# EasyEDA Pro project OpenIPC-Optical(工程文件)2025-11-24.epro, board UrmoukyOpenIPC
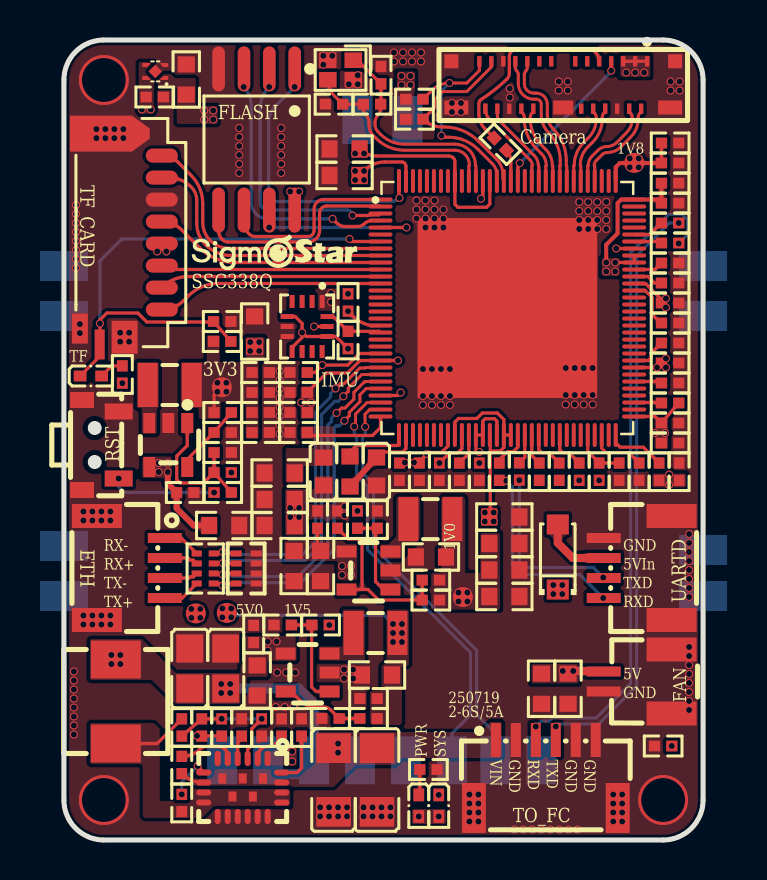
[diagram p7: board, top side]
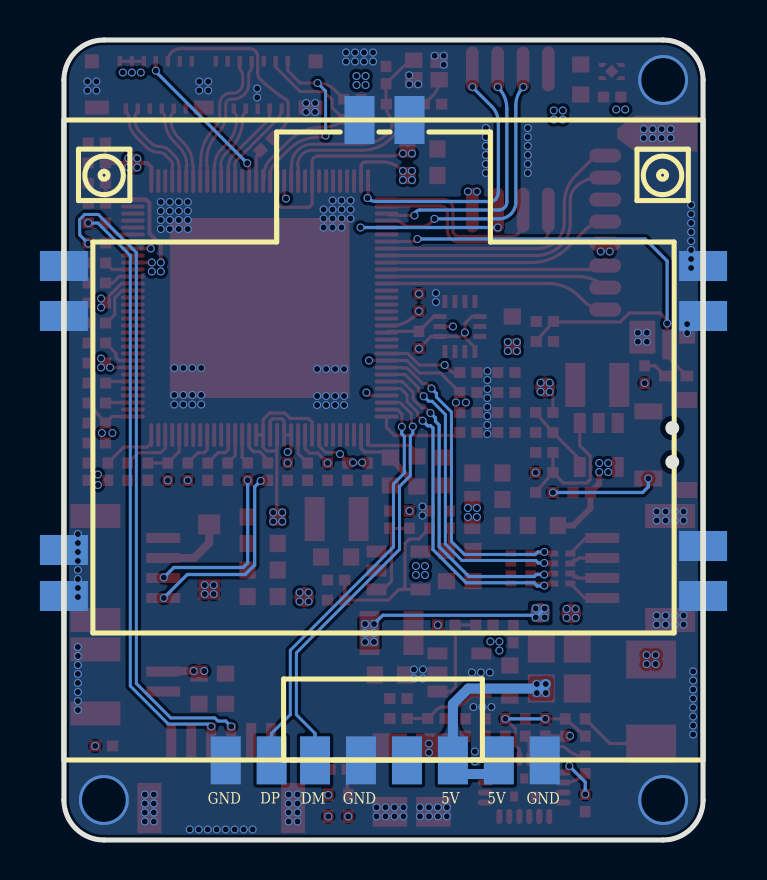
[diagram p8: board, bottom side, seen from below]

Outline 32 x 40 mm; copper layers: Top Layer, Inner1, Inner2, Bottom Layer. Coordinates in mm from the lower left corner of the outline.
Outline path: 0,38 0,2 arc(0.59,0.59) 2,0 30,0 arc(31.41,0.59) 32,2 32,38 arc(31.41,39.41) 30,40 2,40 arc(0.59,39.41) 0,38
Stack: Top Layer 0.035mm 外层铜厚1oz / Dielectric1 0.2104mm 7628 RC49% 8.6mil / Inner1 0.0152mm 内层铜厚 / Dielectric2 1.065mm 1.1mm H/HOZ Copper / Inner2 0.0152mm 内层铜厚 / Dielectric3 0.2104mm 7628 RC49% 8.6mil / Bottom Layer 0.035mm 外层铜厚1oz

## Design rules (mm)
net ETH_TX+: ETH_TX
net ETH_TX-: ETH_TX
net ETH_RX+: ETH_RX
net ETH_RX-: ETH_RX
net XTAL_OUT: XTAL
net XTAL_IN: XTAL
net USB_DM: USB
net USB_DP: USB
net MIPI_D0+: MIPI_D0
net MIPI_CK+: MIPI_CK
net MIPI_CK-: MIPI_CK
net I2C1_SCL: DP1
net I2C1_SDA: DP1
net MIPI_D0-: MIPI_D0
net MIPI_D1+: MIPI_D1
net MIPI_D2+: MIPI_D2
net MIPI_D2-: MIPI_D2
net MIPI_D3+: MIPI_D3
net MIPI_D3-: MIPI_D3
net MIPI_D1-: MIPI_D1
template: 自定义配置
spacing copperThickness1oz (default): track to track 0.102, other pairs 0 to 0.3
spacing copperThickness2oz: track to track 0.203, other pairs 0.152 to 0.3
track width copperThickness1oz (default): min 0.15, default 0.16, max 2
track width copperThickness2oz: min 0.203, default 0.254, max 2.54
differential pair differentialPair (default): width min 0.127, default 0.15, max 2.54; gap min 0.152, default 0.152
via viaSize (default): diameter min 0.4, default 0.4, max 10; hole min 0.3, default 0.3, max 5

## Placement (name value [footprint] x y rotation side)
1V0  -  [Test-Point-0.5mm]  19.97 12.15 0 top
1V5  -  [Test-Point-0.5mm]  8.15 11.36 0 top
1V8  -  [Test-Point-0.5mm]  28.55 33.86 0 top
3V3  -  [Test-Point-0.5mm]  7.91 22.64 0 top
5V0  -  [Test-Point-0.5mm]  6.6 11.33 0 top
C2  22uF  [R0603]  9.55 25.42 270 top
C5  47pF  [R0402]  18.37 12 0 top
C6  10uF  [R0603]  18.38 14.15 0 top
C9  10uF  [R0603]  15.68 8.25 0 top
C11  100nF  [R0402]  15.25 7.08 0 top
C17  10uF  [R0603]  8.03 15.72 180 top
C19  10uF  [R0603]  12.85 13.7 90 top
C20  100nF  [R0402]  12.7 16.02 270 top
C21  10uF  [R0603]  9.68 7.97 90 top
C22  100nF  [R0402]  9.5 10.3 270 top
C23  10uF  [R0603]  14.05 33.22 0 top
C26  1uF  [R0402]  7.95 19.38 180 top
C27  100nF  [R0402]  10.95 10.75 0 top
C28  100nF  [R0402]  15.7 16.02 270 top
C30  10uF  [R0603]  10.8 17.03 0 top
C31  10uF  [R0603]  10.8 15.72 0 top
C32  100nF  [R0402]  18.8 18.42 90 top
C33  100nF  [R0402]  30.35 20.85 180 top
C34  100nF  [R0402]  30.35 19.85 180 top
C35  100nF  [R0402]  30 4.7 0 top
C36  100nF  [R0402]  30.35 26.85 180 top
C37  100nF  [R0402]  11.75 22.38 0 top
C38  100nF  [R0402]  4.55 37.15 180 top
C39  10uF  [R0603]  10.8 18.35 0 top
C40  100nF  [R0402]  11.75 20.38 180 top
C41  10uF  [R0603]  22.05 16.15 180 top
C42  100nF  [R0402]  16.8 18.42 90 top
C43  100nF  [R0402]  17.8 18.42 90 top
C46  10uF  [R0603]  22.05 14.83 180 top
C47  10uF  [R0603]  22.05 13.5 180 top
C48  10uF  [R0603]  22.05 12.17 180 top
C49  10uF  [R0603]  14.05 34.55 0 top
C50  100nF  [R0402]  20.8 18.42 90 top
C51  100nF  [R0402]  11.75 23.38 0 top
C53  100nF  [R0402]  30.35 32.84 180 top
C54  100nF  [R0402]  30.35 31.84 180 top
C57  100nF  [R0402]  30.35 33.85 180 top
C58  100nF  [R0402]  19.8 18.42 90 top
C59  100nF  [R0402]  30.35 24.85 180 top
C60  10uF  [R0603]  14.32 18.42 270 top
C61  100nF  [R0402]  30.8 18.42 90 top
C63  100nF  [R0402]  27.8 18.42 270 top
C64  100nF  [R0402]  11.75 21.38 0 top
C65  100nF  [R0402]  30.35 23.85 0 top
C71  30pF  [R0402]  13.52 36.79 180 top
C72  30pF  [R0402]  15.87 38.24 90 top
C77  33nF  [R0402]  8.9 5.62 270 top
C78  100nF  [R0402]  5.9 1.85 270 top
C79  390pF  [R0402]  7.9 5.62 90 top
C80  22uF  [C0805]  8.1 8.58 270 top
C81  22uF  [C0805]  6.3 8.58 270 top
C82  1uF  [R0402]  11.9 5.62 90 top
C83  22uF  [C1206]  13.5 3 90 top
C84  22uF  [C1206]  15.68 3 90 top
C85  10uF  [R0603]  6.12 38.03 270 top
C86  100nF  [R0402]  30.35 34.85 180 top
C87  10uF  [R0603]  11.53 13.7 90 top
C88  100nF  [R0402]  9.85 20.38 180 top
C89  100nF  [R0402]  9.85 21.38 180 top
C90  100nF  [R0402]  9.85 22.38 180 top
C91  100nF  [R0402]  9.85 23.38 180 top
C92  100nF  [R0402]  6.07 17.38 180 top
C93  10uF  [R0603]  23.91 7.56 90 top
C94  10uF  [R0603]  25.24 7.56 90 top
CN2  SH1.0-4PWB  [CONN-SMD_4P-P1.00_WAFER-SH1.0-4PWB]  28.72 13.6 90 top
CN3  SH1.0-4PWB  [CONN-SMD_4P-P1.00_WAFER-SH1.0-4PWB]  3.35 13.6 270 top
CN6  WAFER-SH1.0-6PWB  [CONN-SMD_6P-P1.00_XUNPU_WAFER-SH1.0-6PWB]  24.12 3.3 0 top
DF1  -  [DF56C-26S-0.3V(51)]  25 37.75 180 top
F1  100nF  [CAP-ARRAY-SMD_0508-8P-L2.0-W1.3-BL]  9.12 13.58 90 top
L2  2.2uH  [IND-SMD_L2.5-W2.0_MHCHL2520]  5.3 22.75 0 top
L3  2.2uH  [IND-SMD_L2.5-W2.0_MHCHL2520]  18.35 16.05 0 top
L4  2.2uH  [IND-SMD_L2.5-W2.0_MHCHL2520]  15.6 10.35 0 top
L5  CBM160808U121T  [L0603]  13 18.42 90 top
L6  CBM160808U600T  [L0603]  15.65 18.42 90 top
L7  10uH  [IND-SMD_L5.2-W5.2_MCW-0530]  2.6 6.92 90 top
LED1  NCD0402G1  [LED0402-RD]  17.77 1.72 270 top
LED2  NCD0402G1  [LED0402-RD]  18.77 1.72 270 top
LED3  NCD0402G1  [LED0402-RD]  1.35 23.2 0 top
R3  150K  [R0402]  7.95 21.38 180 top
R4  51K  [R0402]  18.37 13 0 top
R5  15K  [R0402]  15.25 6.08 0 top
R8  100K  [R0402]  7.95 18.38 180 top
R9  33K  [R0402]  7.95 20.38 180 top
R10  100K  [R0402]  12.85 10.75 180 top
R11  100K  [R0402]  14.7 16.02 270 top
R12  75K  [R0402]  13.7 16.02 270 top
R13  10K  [R0402]  13.35 6.08 0 top
R15  4.7K  [R0402]  18.25 3.53 0 top
R16  4.7K  [R0402]  25.8 18.42 90 top
R19  100  [R0402]  21.8 18.42 90 top
R20  100  [R0402]  22.8 18.42 90 top
R21  4.7K  [R0402]  14.22 25 270 top
R22  4.7K  [R0402]  14.22 26.88 90 top
R23  100  [R0402]  24.8 18.42 90 top
R24  100  [R0402]  23.8 18.42 90 top
R25  4.7K  [R0402]  30.35 22.85 0 top
R26  10K  [R0402]  26.8 18.42 90 top
R27  4.7K  [R0402]  30.35 21.85 0 top
R28  100Ω  [R0402]  7.95 17.38 180 top
R29  4.7K  [R0402]  28.8 18.42 90 top
R30  200K  [R0402]  29.8 18.42 90 top
R35  100K  [R0402]  30.35 25.85 180 top
R36  100  [R0402]  30.35 27.85 180 top
R37  100  [R0402]  30.35 28.85 180 top
R38  100  [R0402]  30.35 29.85 180 top
R39  100  [R0402]  30.35 30.85 180 top
R40  1M/NC  [R0402]  15.42 36.79 180 top
R41  22R  [R0402]  21.85 34.79 135 top
R42  4.7K  [R0402]  17.55 36.04 180 top
R43  4.7K  [R0402]  17.55 37.04 180 top
R44  4.7K  [R0402]  7.93 24.92 0 top
R45  100kΩ  [R0402]  10.9 5.62 270 top
R46  500kΩ  [R0402]  5.9 3.75 90 top
R47  845k  [R0402]  5.9 5.62 90 top
R48  53.6k  [R0402]  6.9 5.62 270 top
R49  10k  [R0402]  9.9 5.62 270 top
R53  NC  [R0402]  7.93 25.92 0 top
R54  4.7K  [R0402]  2.93 23.28 90 top
RN1  10Ω  [RES-ARRAY-SMD_0402-8P-L2.0-W1.0-BL]  7.07 13.58 90 top
SD1  TF-027-H300  [TF-SMD_HYCW104-TF08-375B]  2.85 30.05 90 top
SW1  TS24CA 250gf 013  [SW-SMD_L4.7-W3.5-P3.35-EH]  1.82 19.75 90 top
U1  -  [QFN128_12.3_12.3]  22.2 26.6 0 top
U3  TMI3113B  [SOT-23-5_L2.9-W1.6-P0.95-LS2.8-BR]  5.22 19.75 90 top
U4  TMI3411  [SOT-23-5_L2.9-W1.6-P0.95-LS2.8-BL]  15.25 13.47 90 top
U5  TMI3408F  [SOT-23-5_L2.9-W1.6-P0.95-LS2.8-BL]  12.2 8.38 90 top
U7  W25Q128JVSIQ  [SOIC-8_L5.3-W5.3-P1.27-LS8.0-BL]  9.65 35.03 180 top
U9  ICM-42670-P  [LGA-14_L3.0-W2.5-P0.50-TL_QMI8658A]  12.18 25.67 270 top
U11  MP9447GL-Z  [QFN-20_L4.0-W3.0_MP9447GL]  8.95 2.62 270 top
U13  -  [BL-M8812EU2]  16 20 180 bottom
U14  DS8561-18D4  [DFN-4_L1.0-W1.0-P0.65-BL-EP]  4.57 38.42 90 top
U15  DSS210  [SOD-123_L2.7-W1.8-LS3.7-RD]  24.72 14.15 90 top
U18  BX-SH1.0-2PWT  [CONN-SMD_2P-P1.00_BX-SH1.0-2PWT]  28.72 7.92 90 top
X1  24MHz  [CRYSTAL-SMD_4P-L2.0-W1.6-BL-A]  13.85 38.5 180 top

## Footprints (pads in the part's own frame, mm; a bottom-side part is the same pattern mirrored in y, then rotated)
BL-M8812EU2
  rect 1.5x2.4 smd: 1(-7.9,-16.019) 2(-5.6,-16.019) 3(-3.427,-16.019) 4(-1.127,-16.019) 5(1.173,-16.019) 6(3.473,-16.019) 7(5.773,-16.019) 8(8.073,-16.019) 13(1.3,16) 14(-1.2,16)
  rect 2.4x1.5 smd: 9(16,-7.8) 10(16,-5.3) 11(16,6.2) 12(16,8.7) 15(-16,8.7) 16(-16,6.2) 17(-16,-5.5) 18(-16,-7.8)
C0805
  rect 1.41x1.35 smd: 1(-1,0) 2(1,0)
C1206
  rect 1.485x1.728 smd: 1(-1.593,0) 2(1.593,0)
CAP-ARRAY-SMD_0508-8P-L2.0-W1.3-BL
  rect 0.3x0.55 smd: 1(-0.75,-0.5) 2(-0.25,-0.5) 3(0.25,-0.5) 4(0.75,-0.5) 5(0.75,0.5) 6(0.25,0.5) 7(-0.25,0.5) 8(-0.75,0.5)
CONN-SMD_2P-P1.00_BX-SH1.0-2PWT
  rect 0.5x1.7 smd: 1(-0.5,1.7) 2(0.5,1.7)
  rect 1.2x2.5 smd: 3(1.6,-1.7) 4(-1.6,-1.7)
CONN-SMD_4P-P1.00_WAFER-SH1.0-4PWB
  rect 0.5x1.7 smd: 1(-1.5,1.7) 2(-0.5,1.7) 3(0.5,1.7) 4(1.5,1.7)
  rect 1.2x2.5 smd: 5(-2.6,-1.7) 6(2.6,-1.7)
CONN-SMD_6P-P1.00_XUNPU_WAFER-SH1.0-6PWB
  rect 0.5x1.7 smd: 1(-2.5,1.7) 2(-1.5,1.7) 3(-0.5,1.7) 4(0.5,1.7) 5(1.5,1.7) 6(2.5,1.7)
  rect 1.2x2.5 smd: 7(3.6,-1.7) 8(-3.6,-1.7)
CRYSTAL-SMD_4P-L2.0-W1.6-BL-A
  rect 0.875x0.775 smd: 1(-0.638,-0.488) 2(0.638,-0.488) 3(0.638,0.488) 4(-0.638,0.488)
DF56C-26S-0.3V(51)
  rect 0.22x0.52 smd: 1(-4.2,-1.185) 2(-3.9,1.185) 3(-3.6,-1.185) 4(-3.3,1.185) 5(-3,-1.185) 6(-2.7,1.185) 7(-2.4,-1.185) 8(-2.1,1.185) 9(-1.8,-1.185) 10(-1.5,1.185) 11(-1.2,-1.185) 12(-0.9,1.185) 13(-0.6,-1.185) 14(0.6,-1.185) 16(1.2,-1.185) 17(1.5,1.185) 18(1.8,-1.185) 19(2.1,1.185) 20(2.4,-1.185) 21(2.7,1.185) 22(3,-1.185) 23(3.3,1.185) 24(3.6,-1.185) 25(3.9,1.185) 26(4.2,-1.185)
  rect 1x0.7 smd: 27(0,1.125)
  rect 1.2x0.7 smd: 28(-5.35,1.125) 29(5.35,1.125)
  rect 0.7x0.7 smd: 30(-5.6,-1.185) 31(5.6,-1.185)
DFN-4_L1.0-W1.0-P0.65-BL-EP
  custom 0.2x0.4 smd: 1(-0.325,-0.475) 2(0.325,-0.474) 3(0.325,0.475) 4(-0.325,0.475)
  rect 0.48x0.48 smd rot 45: 5(0.004,0.001)
IND-SMD_L2.5-W2.0_MHCHL2520
  rect 1x2.2 smd: 1(-1.1,0) 2(1.1,0)
IND-SMD_L5.2-W5.2_MCW-0530
  rect 1.9x2.5 smd: 1(-2.1,0) 2(2.1,0)
L0603
  rect 0.8x0.864 smd: 1(-0.7,0) 2(0.7,0)
LED0402-RD
  rect 0.636x0.54 smd: 1(-0.538,0) 2(0.538,0)
LGA-14_L3.0-W2.5-P0.50-TL_QMI8658A
  rect 0.65x0.25 smd: 1(-1.25,0.75) 2(-1.25,0.25) 3(-1.25,-0.25) 4(-1.25,-0.75) 8(1.25,-0.75) 9(1.25,-0.25) 10(1.25,0.25) 11(1.25,0.75)
  rect 0.25x0.65 smd: 5(-0.5,-1) 6(0,-1) 7(0.5,-1) 12(0.5,1) 13(0,1) 14(-0.5,1)
QFN128_12.3_12.3
  oval 1.2x0.2 smd: 1(-6.35,5.425) 2(-6.35,5.075) 3(-6.35,4.725) 4(-6.35,4.375) 5(-6.35,4.025) 6(-6.35,3.675) 7(-6.35,3.325) 8(-6.35,2.975) 9(-6.35,2.625) 10(-6.35,2.275) 11(-6.35,1.925) 12(-6.35,1.575) 13(-6.35,1.225) 14(-6.35,0.875) 15(-6.35,0.525) 16(-6.35,0.175) 17(-6.35,-0.175) 18(-6.35,-0.525) 19(-6.35,-0.875) 20(-6.35,-1.225) 21(-6.35,-1.575) 22(-6.35,-1.925) 23(-6.35,-2.275) 24(-6.35,-2.625) 25(-6.35,-2.975) 26(-6.35,-3.325) 27(-6.35,-3.675) 28(-6.35,-4.025) 29(-6.35,-4.375) 30(-6.35,-4.725) 31(-6.35,-5.075) 32(-6.35,-5.425) 65(6.35,-5.425) 66(6.35,-5.075) 67(6.35,-4.725) 68(6.35,-4.375) 69(6.35,-4.025) 70(6.35,-3.675) 71(6.35,-3.325) 72(6.35,-2.975) 73(6.35,-2.625) 74(6.35,-2.275) 75(6.35,-1.925) 76(6.35,-1.575) 77(6.35,-1.225) 78(6.35,-0.875) 79(6.35,-0.525) 80(6.35,-0.175) 81(6.35,0.175) 82(6.35,0.525) 83(6.35,0.875) 84(6.35,1.225) 85(6.35,1.575) 86(6.35,1.925) 87(6.35,2.275) 88(6.35,2.625) 89(6.35,2.975) 90(6.35,3.325) 91(6.35,3.675) 92(6.35,4.025) 93(6.35,4.375) 94(6.35,4.725) 95(6.35,5.075) 96(6.35,5.425)
  oval 0.2x1.2 smd: 33(-5.425,-6.35) 34(-5.075,-6.35) 35(-4.725,-6.35) 36(-4.375,-6.35) 37(-4.025,-6.35) 38(-3.675,-6.35) 39(-3.325,-6.35) 40(-2.975,-6.35) 41(-2.625,-6.35) 42(-2.275,-6.35) 43(-1.925,-6.35) 44(-1.575,-6.35) 45(-1.225,-6.35) 46(-0.875,-6.35) 47(-0.525,-6.35) 48(-0.175,-6.35) 49(0.175,-6.35) 50(0.525,-6.35) 51(0.875,-6.35) 52(1.225,-6.35) 53(1.575,-6.35) 54(1.925,-6.35) 55(2.275,-6.35) 56(2.625,-6.35) 57(2.975,-6.35) 58(3.325,-6.35) 59(3.675,-6.35) 60(4.025,-6.35) 61(4.375,-6.35) 62(4.725,-6.35) 63(5.075,-6.35) 64(5.425,-6.35) 97(5.425,6.35) 98(5.075,6.35) 99(4.725,6.35) 100(4.375,6.35) 101(4.025,6.35) 102(3.675,6.35) 103(3.325,6.35) 104(2.975,6.35) 105(2.625,6.35) 106(2.275,6.35) 107(1.925,6.35) 108(1.575,6.35) 109(1.225,6.35) 110(0.875,6.35) 111(0.525,6.35) 112(0.175,6.35) 113(-0.175,6.35) 114(-0.525,6.35) 115(-0.875,6.35) 116(-1.225,6.35) 117(-1.575,6.35) 118(-1.925,6.35) 119(-2.275,6.35) 120(-2.625,6.35) 121(-2.975,6.35) 122(-3.325,6.35) 123(-3.675,6.35) 124(-4.025,6.35) 125(-4.375,6.35) 126(-4.725,6.35) 127(-5.075,6.35) 128(-5.425,6.35)
  rect 9x9 smd: 129(0,0)
QFN-20_L4.0-W3.0_MP9447GL
  oval 0.76x0.3 smd: 1(-1.45,1.25) 2(-1.45,0.75) 3(-1.45,0.25) 4(-1.45,-0.25) 5(-1.45,-0.75) 6(-1.45,-1.25) 11(1.45,-1.25) 12(1.45,-0.75) 13(1.45,-0.25) 14(1.45,0.25) 15(1.45,0.75) 16(1.45,1.25)
  oval 0.3x0.76 smd: 7(-0.75,-1.95) 8(-0.25,-1.95) 9(0.25,-1.95) 10(0.75,-1.95) 17(0.75,1.95) 18(0.25,1.95) 19(-0.25,1.95) 20(-0.75,1.95)
  rect 0.5x0.4 smd: 21(-0.45,1.02) 22(-0.45,0) 23(-0.45,-1.02) 24(0.45,0.51) 25(0.45,-0.51)
R0402
  rect 0.566x0.54 smd: 1(-0.433,0) 2(0.433,0)
R0603
  rect 0.806x0.864 smd: 1(-0.753,0) 2(0.753,0)
RES-ARRAY-SMD_0402-8P-L2.0-W1.0-BL
  rect 0.3x0.505 smd: 1(-0.75,0.427) 2(-0.25,0.427) 3(0.25,0.427) 4(0.75,0.427) 5(0.75,-0.427) 6(0.25,-0.427) 7(-0.25,-0.427) 8(-0.75,-0.427)
SOD-123_L2.7-W1.8-LS3.7-RD
  rect 1x1.1 smd: 1(-1.627,0) 2(1.627,0)
SOIC-8_L5.3-W5.3-P1.27-LS8.0-BL
  oval 0.63x2.25 smd: 1(-1.905,-3.53) 2(-0.635,-3.53) 3(0.635,-3.53) 4(1.905,-3.53) 5(1.905,3.53) 6(0.635,3.53) 7(-0.635,3.53) 8(-1.905,3.53)
SOT-23-5_L2.9-W1.6-P0.95-LS2.8-BL
  rect 0.6x1 smd: 1(-0.95,-1.1) 2(0,-1.1) 3(0.95,-1.1) 4(0.95,1.1) 5(-0.95,1.1)
SOT-23-5_L2.9-W1.6-P0.95-LS2.8-BR
  rect 1x0.6 smd: 1(1.1,-0.95) 2(1.1,0) 3(1.1,0.95) 4(-1.1,0.95) 5(-1.1,-0.95)
SW-SMD_L4.7-W3.5-P3.35-EH
  rect 0.8x1.4 smd: 1(-1.675,-0.917) 2(1.675,-0.917)
  rect 0.8x1.2 smd: 3(-2.25,0.917) 4(2.25,0.917)
Test-Point-0.5mm
  round 1 smd: 1(0,0)
TF-SMD_HYCW104-TF08-375B
  oval 0.7x1.6 smd: 1(-3.53,-2.05) 2(-2.43,-2.05) 3(-1.33,-2.05) 4(-0.23,-2.05) 5(0.87,-2.05) 6(1.97,-2.05) 7(3.07,-2.05) 8(4.17,-2.05)
  rect 1.5x0.5 smd: 9(-5.27,1.06)
  rect 1.5x0.8 smd: 10(-4.48,2.05)
  rect 1.65x1.3 smd: 11(-4.91,-0.19)
  custom 1.8x4 smd: 11(5.27,0.55)

## Nets
As in the schematic.

Pads without a net: DF1 11 12 13 14 16; U1 14 15 16 17 18 35 36 37 38 39 66 74 75 76 77 78 79 80 81 82 92 93 94 95 98 99 110 119 121 122 123 124 125 126; U9 2 3 4 9 10 11; U11 6; U13 5

## Via types
v1: diameter 0.4, hole 0.3, Top Layer to Bottom Layer, 388 vias
v2: diameter 2.5, hole 2.2, Top Layer to Bottom Layer, 3 vias

## Routing (per net, layer and track width the routed paths; a pad name or vN(x,y) marks a point on that pad's centre or on a via; arc(x,y) is an arc through that point)
1V0: length 76.2
  Top Layer w0.16: v1(27.6,28.88) U1.87 U1.88 ; C51.2 12.57,23.38 v1(12.94,23.75) 14.21,23.75 14.79,24.33 U1.23 ; 21.68,20.25 21.68,20.95 21.56,21.06 21.09,21.06 20.97,20.95 U1.45 U1.44 20.62,19.4 ; U1.115 21.32,31.8 21.16,31.64 19.72,31.64 19.57,31.79 U1.120 19.57,33.92 arc(19.56,34.02) 19.5,34.1 arc(19.39,34.17) 19.26,34.2 15.65,34.2 arc(15.34,34.24) 15.05,34.36 arc(14.92,34.45) C49.2
  Top Layer w0.2: v1(27.15,28.88) 27.15,29.76 27.72,30.33 27.72,31.84 27.9,32.03 U1.96 29.73,32.03 C54.2 C53.2
  Inner2 w0.16: v1(20.8,18.85) v1(20.8,19.4)
  Inner2 w0.4: 19.97,17.25 16.2,17.25 15.7,17.75 15.7,22.15 15,22.85 ; 19.97,17.25 19.97,17.97 20.8,18.8 v1(20.8,18.85) ; 19.97,17.25 1V0.1 v1(20.2,11.92) ; v1(27.6,28.42) 27.4,28.22 27.4,23.45 26.88,22.92 15.05,22.92 15,22.88 ; 15,22.88 15,30.72 15.78,31.5 15.78,33.92 15.38,34.33 v1(15.03,34.33) v1(14.58,34.33) ; 15,22.88 15,22.85 ; 15,22.85 14.1,23.75 v1(12.94,23.75) 12.93,23.74
  vias: v1(19.75,12.38) v1(19.75,11.92) v1(20.2,12.38) v1(27.15,28.42)
1V5: length 41
  Top Layer w0.16: 21.35,16.15 21.35,20.23 U1.46 ; U1.40 19.22,19.7 18.9,19.38 18.25,19.38 v1(18.18,19.3) 17.8,18.92 17.8,18.85 ; U1.48 22.03,19.62 21.85,19.45 21.38,19.45 ; U1.48 U1.49 ; U1.48 22.03,21.03 21.7,21.35 20.95,21.35 20.68,21.08 19.75,21.08 19.57,20.89 19.57,20.25 U1.41 ; 17.53,18.85 16.8,18.85
  Inner2 w0.16: v1(16.47,10.35) v1(16.93,10.35)
  Inner2 w0.4: 21.3,16.15 21.3,10.75 20.9,10.35 v1(16.93,10.35) ; 21.3,16.15 v1(21.52,16.38) ; 21.3,16.15 21.3,18.22 21.53,18.45 21.53,19.72 21.21,20.04 18.69,20.04 v1(17.53,18.88)
  Bottom Layer w0.16: v1(16.47,10.8) 16.04,11.24 8.26,11.24 8.15,11.35 8.15,11.36 v1(7.93,11.58)
  vias: v1(7.93,11.13) v1(8.38,11.58) v1(8.38,11.13) v1(16.47,9.9) v1(16.93,10.8) v1(16.93,9.9) v1(17.07,18.88) v1(21.07,16.38) v1(21.07,15.92) v1(21.52,15.92)
1V8: length 29.4
  Top Layer w0.16: C86.2 29.92,33.85
  Top Layer w0.2: U1.97 27.62,33.64 27.83,33.85 C57.2
  Inner2 w0.4: 17.12,37.97 v1(16.9,37.75) 15.4,36.25 ; 15.4,36.25 18.72,36.25 19.25,35.72 26.69,35.72 v1(28.33,34.08) v1(28.78,33.63) ; 15.4,36.25 7.25,36.25 v1(7.03,36.47)
  vias: v1(7.03,36.03) v1(7.47,36.47) v1(7.47,36.03) v1(16.9,38.2) v1(17.35,38.2) v1(17.35,37.75) v1(28.33,33.63) v1(28.78,34.08)
3V3: length 27.5
  Top Layer w0.16: 3V3.1 v1(7.68,22.41) 7.52,22.25 R3.2 ; v1(14.22,24.57) 13.62,25.17 U9.12 12.12,25.17 v1(11.93,25.38) ; U1.127 17.12,33.67 arc(17.11,33.77) 17.05,33.85 arc(16.99,33.89) 16.93,33.9 16.05,33.9 arc(15.52,33.79) 15.07,33.5 C23.2 ; v1(20.88,32.07) 20.97,32.16 U1.116 ; v1(16.72,23.97) U1.24 14.82,23.97 14.2,23.35 13.15,23.35 12.18,22.38 C37.2 ; DF1.1 DF1.3 DF1.5 ; v1(16.86,22.37) 16.71,22.22 U1.29 ; 28.55,29.58 v1(27.65,29.58) ; U1.42 19.93,19.57 19.7,19.34 19.29,19.34 v1(18.8,18.85) ; C36.2 29.87,26.9 29.87,27.08 29.59,27.35 29.59,27.35 29.4,27.54 29.4,27.54 29.12,27.83 U1.84 ; v1(11.93,25.38) 11.93,25.13 11.43,24.63 U9.8 ; v1(11.93,25.38) 11.93,25.83 11.57,26.17 U9.5 ; C65.1 v1(29.69,23.62) U1.72 ; U1.65 29.59,21.17 C33.2 R27.2
  vias: v1(2.93,22.84) v1(3.9,36.53) v1(4.35,36.53) v1(4.68,29.42) v1(5.12,29.42) v1(7.68,22.86) v1(8.13,22.86) v1(8.13,22.41) v1(9.32,24.9) v1(9.32,24.45) v1(9.78,24.9) v1(9.78,24.45) v1(11.32,32.42) v1(11.32,16.6) v1(11.32,16.15) v1(11.78,32.42) v1(11.78,16.6) v1(11.78,16.15) v1(11.88,21.88) v1(12.38,21.88) v1(14.22,27.31) v1(14.58,33.45) v1(14.58,33) v1(15.03,33.45) v1(15.03,33) v1(17.77,1.18) v1(18.77,1.18) v1(26.8,17.98) v1(28.15,38.38) v1(28.6,38.38) v1(29.05,38.38) v1(29.57,20.35) v1(30.14,27.08) v1(30.14,26.62) v1(30.14,24.08) v1(30.14,23.62) v1(30.1,20.35) v1(30.3,18.28) v1(30.3,17.75) v1(30.43,4.7)
3V3EN: length 7.5
  Top Layer w0.16: R8.2 8.38,17.38 ; R8.2 6.99,17.85 5.82,17.85 5.65,18.03 5.65,19.2 6.18,19.72 6.18,20.85 ; R8.2 C26.2
5V: length 61.4
  Top Layer w0.16: v1(6.66,5.21) 7.88,5.21 C79.1 ; C19.2 12.7,14.6 C20.2
  Top Layer w0.3: v1(5.2,18.4) 5.2,17.82 C92.2 5.64,16.58 6.5,15.72 C17.2
  Top Layer w0.4: v1(25.5,8.45) 27,8.45 U18.2
  Inner2 w0.16: v1(14.38,13.7) 14.7,14.02 v1(14.7,16.45) ; v1(4.75,18.85) v1(5.2,18.4) 8.36,18.4 v1(8.38,18.38)
  Inner2 w0.4: v1(8.32,7.35) 8.47,7.5 23.85,7.5 24.73,8.38 ; v1(24.5,12.3) 24.73,12.07 24.73,8.38 ; v1(25.5,8.45) 24.8,8.45 24.73,8.38 ; 14.15,13.47 14.15,11.62 v1(13.28,10.75) 12.46,9.92 v1(10.65,9.92) ; v1(5.2,18.4) 6.61,16.99 6.61,11.33 v1(6.83,11.11)
  Bottom Layer w0.5: U13.7 10.23,3.62 10.55,3.3 12.2,3.3 12.53,3.63 12.53,3.83 ; U13.6 12.53,6.8 11.75,7.58 C80.2 v1(7.88,7.8)
  vias: v1(2.38,9.25) v1(2.38,8.8) v1(2.82,9.25) v1(2.82,8.8) v1(4.75,18.4) v1(5.2,18.85) v1(6.38,11.56) v1(6.38,11.11) v1(6.83,11.56) v1(7.88,7.35) v1(8.32,7.8) v1(10.2,9.92) v1(10.2,9.47) v1(13.93,13.7) v1(13.93,13.25) v1(14.38,13.25) v1(24.5,12.75) v1(24.95,12.75) v1(24.95,12.3) v1(24.97,8.45)
AVDD_AUD: length 4.4
  Top Layer w0.16: C40.1 12.33,20.22 15.45,20.22 15.85,20.62 U1.32
GND:
  vias: v1(0.5,8.42) v1(0.5,7.97) v1(0.5,7.53) v1(0.5,7.08) v1(0.5,6.62) v1(0.5,6.17) v1(0.5,5.72) v1(0.5,5.28) v1(0.6,31.75) v1(0.6,31.3) v1(0.6,30.85) v1(0.6,30.4) v1(0.6,29.95) v1(0.6,29.5) v1(0.6,29.05) v1(0.6,28.6) v1(0.8,25.8) v1(0.8,25.34) v1(0.97,16.42) v1(0.97,15.97) v1(0.97,11.22) v1(0.97,10.78) v1(1.43,16.42) v1(1.43,15.97) v1(1.43,11.22) v1(1.43,10.78) v1(1.62,35.55) v1(1.62,35.09) v1(1.88,16.42) v1(1.88,15.97) v1(1.88,11.22) v1(1.88,10.78) v1(2.07,35.55) v1(2.07,35.09) v1(2.32,16.42) v1(2.32,15.97) v1(2.32,11.22) v1(2.32,10.78) v1(2.53,35.55) v1(2.53,35.09) v1(2.81,25.36) v1(2.81,24.92) v1(2.97,35.55) v1(2.97,35.09) v1(3.26,25.36) v1(3.26,24.92) v1(8.78,35.6) v1(8.78,35.15) v1(8.78,34.7) v1(8.78,34.25) v1(8.78,33.8) v1(8.78,33.35) v1(10.6,6.65) v1(10.68,8.38) v1(10.8,23.45) v1(10.8,23) v1(10.8,22.55) v1(10.8,22.1) v1(10.8,21.65) v1(10.8,21.2) v1(10.8,20.75) v1(10.8,20.3) v1(10.88,35.6) v1(10.88,35.15) v1(10.88,34.7) v1(10.88,34.25) v1(10.88,33.8) v1(10.88,33.35) v1(11.12,8.38) v1(11.05,6.65) v1(11.43,4.42) v1(11.43,3.93) v1(11.5,6.65) v1(11.57,8.38) v1(12.82,1.63) v1(12.82,1.18) v1(12.99,39.21) v1(12.99,38.76) v1(13.28,1.63) v1(13.28,1.18) v1(13.44,39.21) v1(13.38,27.35) v1(13.38,26.9) v1(13.72,1.63) v1(13.72,1.18) v1(14.03,8.53) v1(14.03,8.08) v1(14.05,16.67) v1(14.05,16.22) v1(14.18,1.63) v1(14.18,1.18) v1(14.26,37.79) v1(14.47,8.53) v1(14.47,8.08) v1(14.71,38.24) v1(14.71,37.79) v1(15,1.63) v1(15,1.18) v1(15.45,1.63) v1(15.45,1.18) v1(15.9,1.63) v1(15.9,1.18) v1(16.35,1.63) v1(16.35,1.18) v1(16.53,39.38) v1(16.53,38.92) v1(16.97,39.38) v1(16.97,38.92) v1(17.43,39.38) v1(17.43,38.92) v1(17.65,31.97) v1(17.65,31.53) v1(17.65,31.08) v1(17.88,39.38) v1(17.88,38.92) v1(17.97,23.55) v1(17.97,22.2) v1(17.97,21.75) v1(18.1,31.97) v1(18.1,31.53) v1(18.1,31.08) v1(18.1,30.62) v1(18.43,23.55) v1(18.43,22.2) v1(18.43,21.75) v1(18.55,31.97) v1(18.55,31.53) v1(18.55,31.08) v1(18.55,30.62) v1(18.88,23.55) v1(18.88,22.2) v1(18.88,21.75) v1(19,31.53) v1(19,31.08) v1(19,30.62) v1(19.32,23.55) v1(19.32,22.2) v1(19.32,21.75) v1(19.43,36.85) v1(19.43,36.4) v1(19.88,36.85) v1(19.88,36.4) v1(20.3,2.28) v1(20.3,1.82) v1(20.3,1.38) v1(20.3,0.93) v1(20.75,2.28) v1(20.75,1.82) v1(20.75,1.38) v1(20.75,0.93) v1(22.32,37.58) v1(22.32,37.12) v1(22.55,0.53) v1(23,0.53) v1(23.45,0.53) v1(23.9,0.53) v1(24.35,0.53) v1(24.78,37.92) v1(24.78,37.47) v1(24.8,0.53) v1(25.12,23.6) v1(25.12,22.25) v1(25.12,21.78) v1(25.22,37.92) v1(25.22,37.47) v1(25.25,0.53) v1(25.57,23.6) v1(25.57,22.25) v1(25.57,21.78) v1(25.7,0.53) v1(25.8,31.9) v1(25.8,31.45) v1(25.8,31) v1(25.8,30.55) v1(26.03,23.6) v1(26.03,22.25) v1(26.03,21.78) v1(26.25,31.9) v1(26.25,31.45) v1(26.25,31) v1(26.25,30.55) v1(26.47,23.6) v1(26.47,22.25) v1(26.47,21.78) v1(26.7,31.9) v1(26.7,31.45) v1(26.7,31) v1(26.7,30.55) v1(27.15,31.9) v1(27.15,31.45) v1(27.15,31) v1(27.15,30.55) v1(27.5,2.28) v1(27.5,1.82) v1(27.5,1.38) v1(27.5,0.93) v1(27.95,2.28) v1(27.95,1.82) v1(27.95,1.38) v1(27.95,0.93) v1(30.38,37.92) v1(30.38,37.47) v1(30.82,37.92) v1(30.82,37.47) v1(31.3,15.3) v1(31.3,14.85) v1(31.3,14.4) v1(31.3,13.95) v1(31.3,13.5) v1(31.3,13.05) v1(31.3,12.6) v1(31.3,12.15) v1(31.3,9.65) v1(31.3,9.2) v1(31.3,8.75) v1(31.3,8.3) v1(31.3,7.85) v1(31.3,7.4) v1(31.3,6.95) v1(31.3,6.5) v2(2,38) v2(2,2) v2(30,2)
VIN: length 1.2
  Top Layer w0.16: U11.8 6.97,2.88 arc(6.39,2.99) R46.1
  vias: v1(13.72,4.82) v1(13.72,4.37)
AUD_VRM: length 4.3
  Top Layer w0.16: L6.2 15.93,19.4 16.95,19.4 17.12,19.58 U1.34
  Top Layer w0.3: C60.2 L6.2
ETH_RX+: length 16.8
  Top Layer w0.15: F1.6 RN1.6 ; v1(13.99,22.19) 14.24,22.43 14.24,22.6 14.92,23.28 15.85,23.28
  Bottom Layer w0.15: v1(7.95,13.85) 8.25,13.85 8.38,13.97 12.07,13.97 12.9,14.8 12.9,21.27 13.56,21.94 13.74,21.94 v1(13.99,22.19)
ETH_RX-: length 16.8
  Top Layer w0.15: v1(13.6,22.58) 13.85,22.82 14.04,22.82 14.81,23.6 15.08,23.6 15.1,23.62 U1.25 ; F1.5 RN1.5
  Bottom Layer w0.15: v1(13.6,22.58) 13.35,22.33 13.35,22.15 12.6,21.4 12.6,14.92 11.95,14.28 8.4,14.28 8.27,14.4 v1(7.95,14.4)
ETH_TX+: length 17
  Top Layer w0.15: RN1.8 F1.8 ; 15.85,22.58 15.14,22.58 14.82,22.26 14.82,21.92 14.29,21.39 14.29,21.21 v1(14.04,20.96)
  Bottom Layer w0.16: v1(14.04,20.96) 13.79,20.71 13.64,20.71 13.53,20.59 13.53,14.53 11.86,12.86 8.46,12.86 8.3,12.7 7.97,12.7 v1(7.95,12.72)
ETH_TX-: length 17
  Top Layer w0.15: v1(13.65,21.35) 13.9,21.6 14.07,21.6 14.52,22.04 14.52,22.38 15.03,22.9 15.08,22.9 15.1,22.92 U1.27 ; 7.63,13.33 F1.7
  Top Layer w0.16: RN1.7 7.63,13.33
  Bottom Layer w0.16: v1(7.95,13.27) 8.35,13.27 8.45,13.17 11.72,13.17 13.21,14.66 13.21,20.75 13.4,20.93 13.4,21.1 v1(13.65,21.35)
FUART_RX: length 32.3
  Bottom Layer w0.15: v1(23.62,5.67) 23.9,5.95 24.3,5.95 24.45,6.1 26.65,6.1 28.38,7.83 28.38,29.38 30.28,31.28 30.96,31.28 31.21,31.03 31.21,30.25 v1(30.78,29.83)
FUART_TX: length 29.2
  Bottom Layer w0.15: v1(24.62,5.67) 24.75,5.8 26.78,5.8 28.68,7.7 28.68,29.22 30.3,30.85 v1(30.78,30.85)
GPIO0_LED1: length 2
  Top Layer w0.16: 25.8,18.85 25.28,19.37 24.97,19.37 24.82,19.52 U1.56
I2C0_SCL: length 4.8
  Top Layer w0.16: U9.13 v1(12.53,25.67) ; U1.19 15.35,25.72 arc(14.72,25.98) v1(14.22,26.44)
  Inner1 w0.16: v1(12.53,25.67) 12.53,26.2 12.77,26.44 v1(14.22,26.44)
I2C0_SDA: length 3
  Top Layer w0.16: U1.20 15.79,25.43 R21.1 13.48,26.17 U9.14
I2C1_SCL: length 10.5
  Top Layer w0.15: DF1.24 21.4,38.65 20.17,37.42 18.97,37.42 18.57,37.03 18.57,36.63 R42.1 arc(18.42,35.75) 18.93,35.65 19.05,35.65 arc(19.97,35.47) 20.74,34.95 21.66,34.03 arc(21.9,33.68) 21.98,33.27 21.98,33.07 arc(21.99,33) U1.113
I2C1_SDA: length 10.6
  Top Layer w0.15: R43.1 18.43,37.49 arc(18.83,37.76) v1(19.3,37.85) 20.17,37.85 20.8,38.48 DF1.26 ; 21.68,32.95 21.68,33.27 arc(21.62,33.57) 21.45,33.82 20.74,34.52 arc(20.06,34.98) 19.25,35.14 19.09,35.14 arc(18.99,35.16) v1(18.9,35.22)
  Bottom Layer w0.15: v1(18.9,35.22) 18.9,37.45 v1(19.3,37.85)
MIPI_CK+: length 7
  Top Layer w0.15: DF1.18 23.2,38.63 arc(23.18,38.53) 23.13,38.45 arc(23.07,38.37) 23.05,38.27 23.05,37.82 arc(23.19,37.48) 23.52,37.34 23.65,37.34 arc(24.04,37.18) 24.2,36.79 24.2,36.27 arc(24.28,35.88) 24.5,35.55 arc(24.98,34.83) 25.15,33.98 25.15,33.74 arc(25.15,33.73) 25.16,33.71 arc(25.17,33.7) 25.18,33.68 25.18,32.95
MIPI_CK-: length 7
  Top Layer w0.15: DF1.20 22.6,38.63 arc(22.62,38.53) 22.67,38.45 arc(22.73,38.37) 22.75,38.27 22.75,37.82 arc(22.98,37.27) 23.52,37.04 23.65,37.04 arc(23.82,36.97) 23.9,36.79 23.9,36.27 arc(24,35.77) 24.29,35.34 arc(24.7,34.71) 24.85,33.98 24.85,33.74 arc(24.85,33.73) 24.84,33.71 arc(24.83,33.7) 24.82,33.68 U1.105
MIPI_D0+: length 4.7
  Top Layer w0.15: U1.100 26.57,33.68 arc(26.57,33.7) 26.56,33.71 arc(26.55,33.73) 26.55,33.74 arc(26.58,33.86) 26.65,33.97 26.94,34.27 arc(27.06,34.35) 27.2,34.37 arc(27.57,34.45) 27.88,34.66 28.38,35.16 arc(28.66,35.56) 28.75,36.05 28.75,36.15 arc(28.77,36.25) 28.83,36.33 arc(28.88,36.41) 28.9,36.51
MIPI_D0-: length 4.7
  Top Layer w0.15: U1.101 26.22,33.68 arc(26.23,33.7) 26.24,33.71 arc(26.25,33.73) 26.25,33.74 arc(26.3,33.98) 26.43,34.18 26.73,34.48 arc(26.95,34.62) 27.2,34.67 arc(27.45,34.73) 27.67,34.87 28.17,35.37 arc(28.38,35.68) 28.45,36.05 28.45,36.15 arc(28.43,36.25) 28.37,36.33 arc(28.32,36.41) 28.3,36.51
MIPI_D1+: length 3.9
  Top Layer w0.15: U1.102 25.88,33.68 arc(25.87,33.7) 25.86,33.71 arc(25.85,33.73) 25.85,33.74 arc(25.95,34.23) 26.23,34.65 26.48,34.9 arc(26.83,35.42) 26.95,36.05 26.95,36.15 arc(26.97,36.25) 27.03,36.33 arc(27.08,36.41) 27.1,36.51
MIPI_D1-: length 3.9
  Top Layer w0.15: U1.103 25.53,33.68 arc(25.53,33.7) 25.54,33.71 arc(25.55,33.73) 25.55,33.74 arc(25.67,34.35) 26.01,34.86 26.26,35.11 arc(26.55,35.54) 26.65,36.05 26.65,36.15 arc(26.63,36.25) 26.57,36.33 arc(26.52,36.41) 26.5,36.51
MIPI_D2+: length 3.9
  Top Layer w0.15: U1.106 24.47,33.68 arc(24.47,33.7) 24.46,33.71 arc(24.45,33.73) 24.45,33.74 arc(24.37,34.17) 24.13,34.53 23.88,34.78 arc(23.49,35.36) 23.35,36.05 23.35,36.15 arc(23.37,36.25) 23.43,36.33 arc(23.48,36.41) 23.5,36.51
MIPI_D2-: length 3.9
  Top Layer w0.15: U1.107 24.12,33.68 arc(24.13,33.7) 24.14,33.71 arc(24.15,33.73) 24.15,33.74 arc(24.09,34.05) 23.91,34.31 23.66,34.56 arc(23.21,35.24) 23.05,36.05 23.05,36.15 arc(23.03,36.25) 22.97,36.33 arc(22.92,36.41) 22.9,36.51
MIPI_D3+: length 4.4
  Top Layer w0.15: 23.78,32.95 23.78,33.68 arc(23.77,33.7) 23.76,33.71 arc(23.75,33.73) 23.75,33.74 arc(23.7,33.99) 23.56,34.21 21.82,35.94 arc(21.73,36.08) 21.7,36.24 DF1.23
MIPI_D3-: length 4.5
  Top Layer w0.15: U1.109 23.43,33.68 arc(23.43,33.7) 23.44,33.71 arc(23.45,33.73) 23.45,33.74 arc(23.42,33.88) 23.34,33.99 21.33,36.01 arc(21.16,36.26) DF1.25
MIPI_MCLK: length 10.1
  Top Layer w0.16: R41.2 21.09,35.55 arc(20.86,35.9) 20.77,36.32 20.77,36.83 arc(20.8,36.94) 20.87,37.02 arc(21.55,37.5) 22.17,38.04 arc(22.26,38.17) 22.3,38.32 arc(22.3,38.37) 22.3,38.42 22.3,39.17 arc(22.42,39.45) 22.7,39.57 26.17,39.57 arc(26.62,39.38) DF1.9
MIPI_RST: length 7.9
  Top Layer w0.16: DF1.7 27.4,38.47 arc(27.4,38.47) v1(27.4,38.47) ; U1.111 22.72,33.6 arc(22.75,33.73) v1(22.82,33.84)
  Bottom Layer w0.16: v1(22.82,33.84) 27.36,38.38 arc(27.39,38.42) v1(27.4,38.47)
MP9447_FB: length 6.6
  Top Layer w0.16: v1(9.9,6.06) 9.4,5.56 9.4,4.72 9.2,4.53 U11.3 ; v1(7.9,6.06) R48.1 R47.1
  Bottom Layer w0.16: v1(7.9,6.06) v1(9.9,6.06)
MP9447_LC: length 3.8
  Top Layer w0.16: R47.2 4.67,4.83 L7.1
PM_GPIO6: length 2.8
  Top Layer w0.15: 28.8,18.85 28.28,19.37 27.15,19.37 26.93,19.59 U1.62
PM_RESET: length 2.5
  Top Layer w0.16: U1.83 29.1,27.47 29.45,27.12 29.45,26.27 29.88,25.85 R35.2
PM_SPI_SCK: length 1.4
  Top Layer w0.16: R27.1 29.89,21.88 U1.67
PM_SPI_WPZ: length 1.4
  Top Layer w0.16: R25.1 29.84,22.92 U1.70
SD_CDZ: length 28.2
  Top Layer w0.16: R44.2 R53.1 7.47,25.9 4.15,25.9 3.7,26.35 2.15,26.35 1.8,26 v1(1.8,25.83) 1.8,24.79 SD1.9 1.79,24.18 LED3.1 ; v1(14.3,30.05) 14.43,29.92 U1.7
  Bottom Layer w0.16: v1(1.8,25.83) 1.8,28.95 2.9,30.05 v1(14.3,30.05)
SD_CLK: length 11.6
  Top Layer w0.16: U1.10 8.58,28.88 arc(7.6,29.07) 6.78,29.62 5.89,30.51 arc(5.44,30.81) SD1.5
SD_CMD: length 11
  Top Layer w0.16: U1.11 5.37,28.53 arc(5.12,28.58) SD1.3
SD_DATA0: length 13.6
  Top Layer w0.16: U1.9 8.37,29.22 arc(7.68,29.36) 7.1,29.75 arc(6.77,30.25) 6.65,30.84 6.65,31.99 arc(6.58,32.35) 6.38,32.65 arc(5.85,33) 5.24,33.12 SD1.7
SD_DATA1: length 14
  Top Layer w0.16: 15.85,29.58 8.29,29.58 arc(7.77,29.68) 7.32,29.97 arc(7.05,30.39) 6.95,30.88 6.95,31.83 arc(6.8,32.59) 6.37,33.23 5.72,33.88 arc(5.34,34.13) SD1.8
SD_DATA2: length 11.3
  Top Layer w0.16: U1.13 7.73,27.83 arc(6.92,27.66) 6.22,27.2 6,26.98 arc(5.5,26.64) SD1.1
SD_DATA3: length 11.1
  Top Layer w0.16: U1.12 6.24,28.17 arc(5.51,28.03) SD1.2
SPI_CZ: length 13.5
  Top Layer w0.16: 16.78,32.95 16.78,32.16 arc(16.78,32.13) v1(16.8,32.1)
  Bottom Layer w0.16: v1(11.55,37.65) 10.59,36.69 arc(10.34,36.31) 10.25,35.88 10.25,32.39 arc(10.29,32.19) 10.4,32.03 arc(10.51,31.95) 10.64,31.92 16.38,31.92 arc(16.61,31.97) v1(16.8,32.1)
SPI_HOLD: length 9
  Top Layer w0.16: v1(10.28,30.62) 10.28,31.47 arc(10.28,31.48) U7.7 ; U1.5 v1(17.15,30.62)
  Bottom Layer w0.16: v1(17.15,30.62) v1(10.28,30.62)
SPI_SCK: length 9.3
  Top Layer w0.16: U7.6 9.01,30.93 arc(9.08,30.59) 9.28,30.3 arc(9.41,30.21) 9.58,30.17 12.2,30.17 ; 12.53,31.53 12.53,30.47 arc(12.44,30.26) 12.22,30.17 ; U1.1 13,32.03 arc(12.66,31.89) 12.53,31.55
SPI_SDI: length 10.9
  Top Layer w0.16: U7.5 7.75,30.46 arc(7.79,30.22) 7.93,30.03 arc(8.06,29.93) 8.23,29.9 12.22,29.9 arc(12.63,30.07) 12.8,30.47 12.8,31.35 arc(12.9,31.6) 13.15,31.7 15.82,31.7 arc(15.84,31.69) U1.2
SPI_SDO: length 13.2
  Top Layer w0.16: U7.2 10.28,37.67 arc(10.28,37.66) v1(10.28,37.65) ; v1(14.45,31.22) 15.22,31.22 arc(15.29,31.25) 15.35,31.25 15.75,31.25 arc(15.8,31.29) U1.3
  Bottom Layer w0.16: v1(14.45,31.22) arc(14.37,31.42) 14.18,31.5 10.22,31.5 arc(9.94,31.62) 9.82,31.9 9.82,36.56 arc(9.94,37.15) v1(10.28,37.65)
SPI_WPZ: length 13
  Top Layer w0.16: v1(13.45,31.06) 13.66,30.85 arc(13.85,30.72) 14.07,30.67 14.72,30.67 arc(14.89,30.71) 15.03,30.8 arc(15.22,30.93) 15.45,30.97 U1.4
  Bottom Layer w0.16: v1(13.45,31.06) 10.22,31.06 arc(9.62,31.3) 9.38,31.9 9.38,36.74 arc(9.28,37.23) v1(9,37.65)
SW_RST: length 2.6
  Top Layer w0.15: 26.8,18.85 26.22,19.42 U1.60
  Top Layer w0.16: 26.8,18.85 27.8,18.85
UART_RX0: length 9.6
  Bottom Layer w0.16: v1(22.15,17.96) 22.45,17.66 22.45,13.75 22.93,13.28 25.82,13.28 v1(27,12.1)
UART_TX0: length 8.6
  Bottom Layer w0.16: v1(22.8,17.99) 22.8,13.85 23.03,13.62 26.5,13.62 v1(27,13.12)
USB_DM: length 21.6
  Top Layer w0.15: v1(14.53,20.67) 14.6,20.74 14.6,21.3 15.18,21.88 U1.30
  Bottom Layer w0.15: U13.3 19.43,5.33 20.36,6.27 20.36,9.36 15.2,14.53 15.2,16.79 15.2,16.79 15.2,17.67 14.66,18.22 14.66,20.2 14.53,20.32 v1(14.53,20.67)
USB_DP: length 21
  Top Layer w0.15: v1(15.08,20.66) 15.07,20.66 15.07,21.29 15.31,21.53 U1.31
  Bottom Layer w0.15: v1(15.08,20.66) 15.08,20.31 14.96,20.18 14.96,18.34 15.5,17.8 15.5,16.66 15.5,16.66 15.5,14.65 20.66,9.49 20.66,6.27 21.6,5.33 U13.2
XTAL_IN: length 10.8
  Top Layer w0.15: U1.117 20.62,33.68 arc(20.62,33.7) 20.61,33.71 arc(20.6,33.73) 20.6,33.74 20.6,33.76 arc(20.3,34.49) 19.57,34.79 17.05,34.79 arc(16.4,34.92) 15.85,35.29 15.72,35.42 arc(15.61,35.58) 15.57,35.76 15.57,35.89 arc(15.61,36.07) 15.72,36.23 arc(15.82,36.39) 15.86,36.57 R40.1 arc(15.87,36.81) 15.87,36.83 C72.1 14.84,38.84 arc(14.68,38.95) X1.1
XTAL_OUT: length 10.5
  Top Layer w0.15: 20.28,32.95 20.28,33.68 arc(20.28,33.7) 20.29,33.71 arc(20.3,33.73) 20.3,33.74 20.3,33.76 arc(20.08,34.28) 19.57,34.49 17.05,34.49 arc(16.29,34.64) 15.64,35.07 15.5,35.21 arc(15.33,35.46) 15.27,35.76 15.27,35.89 arc(15.24,36.07) 15.13,36.23 arc(15.03,36.39) 14.99,36.57 R40.2 C71.1 13.55,37.2 arc(13.3,37.57) X1.3
$2N79255: length 3.3
  Top Layer w0.16: C60.1 14.32,19.4 14.65,19.72 16.68,19.72 16.78,19.83 16.78,20.25
$2N79483: length 1.6
  Top Layer w0.16: U1.112 22.38,33.95 arc(22.32,34.24) R41.1
$2N80001: length 1.6
  Top Layer w0.16: 20.28,20.25 20.28,19.33 19.8,18.85
$2N80007: length 1.9
  Top Layer w0.16: C59.2 29.4,24.33 29.4,24.12 29.26,23.97 U1.73
$2N80073: length 2
  Top Layer w0.16: 21.8,18.85 21.8,19.02 22.2,19.42 22.5,19.42 22.72,19.64 U1.50
$2N80075: length 1.5
  Top Layer w0.16: R20.2 23.07,19.13 U1.51
$2N80136: length 1.6
  Top Layer w0.16: 23.8,18.85 23.43,19.22 U1.52
$2N80138: length 2
  Top Layer w0.16: 23.78,20.25 23.78,19.52 23.92,19.37 24.28,19.37 24.8,18.85
$2N80309: length 3
  Top Layer w0.16: U1.64 27.62,19.87 27.85,19.64 29.01,19.64 29.8,18.85
$2N80502: length 5.3
  Bottom Layer w0.16: v1(2.74,18.08) 2.74,17.66 3.03,17.38 v1(7.52,17.38)
$2N80698: length 1.5
  Top Layer w0.16: R36.2 29.56,27.85 29.24,28.17 U1.85
$2N80700: length 1.5
  Top Layer w0.16: R37.2 29.59,28.53 U1.86
$2N80702: length 1.4
  Top Layer w0.16: U1.90 29.84,29.92 R38.2
$2N80704: length 1.6
  Top Layer w0.16: 28.55,30.28 29.34,30.28 R39.2
$2N81554: length 1.9
  Top Layer w0.16: CN3.4 5.92,12.1 RN1.1
$2N81555: length 1.7
  Top Layer w0.16: CN3.3 6.27,13.1 6.32,13.16 6.48,13.16 RN1.2
$2N81556: length 1.7
  Top Layer w0.16: CN3.2 6.22,14.1 6.32,14 6.48,14 RN1.3
$2N81557: length 1.9
  Top Layer w0.16: RN1.4 5.87,15.1 CN3.1
$2N98270: length 3.5
  Top Layer w0.4: U15.2 24.72,14.85 25.47,14.1 CN2.3
$3N1560: length 4.6
  Top Layer w0.16: U4.1 16,12.53 15.6,12.92 15.6,15.49 C28.2 R11.2
$3N1564: length 8.8
  Top Layer w0.16: 14.9,12.55 14.93,12.58 14.93,14.83 14.7,15.05 14.23,15.05 R12.2 ; U4.5 15.22,12.53 15.75,12 17.93,12 C5.1 R4.1
$3N1574: length 4.2
  Top Layer w0.16: R5.1 R13.2 13.35,6.51 arc(13.19,6.61) 13.01,6.65 12.57,6.65 arc(12.18,6.73) 11.85,6.95 11.57,7.23 arc(11.35,7.37) U5.5
$3N1578: length 3.6
  Top Layer w0.16: 6.18,18.65 6.18,19.03 R9.2 8.38,21.38
$3N1588: length 5.1
  Top Layer w0.16: U5.1 12.62,7.42 12.4,7.65 12.4,10.73 R10.2 11.38,10.75
$3N3000: length 24.7
  Inner2 w0.16: v1(18.77,2.25) 18.77,6.27 18.93,6.42 26.47,6.42 27.75,7.7 27.75,16.03 v1(25.8,17.98)
$3N3008: length 1.3
  Top Layer w0.16: LED1.1 17.82,2.31 R15.1
$3N13162: length 2.7
  Top Layer w0.16: C82.1 11.9,3.6 11.68,3.38 U11.20
$3N13175: length 1.8
  Top Layer w0.16: U11.2 9.7,4.13 arc(9.75,4.36) 9.88,4.55 arc(10.01,4.64) 10.18,4.67 10.3,4.67 arc(10.46,4.71) 10.6,4.8 10.84,5.03 arc(10.88,5.11) R45.2
$3N13176: length 2.8
  Top Layer w0.16: U11.5 8.2,4.22 arc(8.17,4.39) 8.07,4.53 arc(7.91,4.64) 7.71,4.67 7.13,4.67 arc(6.96,4.64) 6.82,4.55 arc(6.42,4.28) 5.94,4.18 R46.2
$3N13177: length 2.2
  Top Layer w0.16: U11.7 6.7,3.67 v1(6.7,3.7)
  Bottom Layer w0.16: v1(6.7,3.7) 5.9,2.9 v1(5.9,2.28)
$3N13178: length 1.2
  Top Layer w0.16: U11.4 8.7,4.71 arc(8.75,4.97) C77.2
$3N23775: length 1.2
  Top Layer w0.16: LED3.2 2.4,23.71 R54.2

## Copper pours and planes (outline as drawn; the poured copper is in the pictures)
1V0 on Top Layer: 18.3,11.53 18.3,12.74 18.29,12.76 18.29,13.26 18.3,13.27 18.3,13.35 18.38,13.35 18.39,13.36 18.79,13.36 18.89,13.46 18.89,17.08 18.99,17.18 19.99,17.18 20.09,17.08 20.09,13.35 21.82,13.35 21.82,11.53
1V0 on Top Layer: 20.85,15.35 21.82,15.35 21.82,11.53 20.85,11.53
1V5 on Top Layer: 16.2,11.53 16.15,11.47 16.15,8.85 16.07,8.78 15.97,8.78 15.9,8.7 15.9,7.55 15.82,7.47 15.43,7.47 15.32,7.38 15.32,5.85 15.43,5.75 16.82,5.75 16.93,5.85 16.93,8.62 17,8.7 17.2,8.7 17.28,8.78 17.28,11.47 17.22,11.53
1V5 on Bottom Layer: 16.25,11.03 17.15,11.03 17.15,9.67 16.25,9.67
1V5 on Inner2: 16.25,11.03 17.15,11.03 17.15,9.67 16.25,9.67
1V8 on Top Layer: 5.65,37.6 5.6,37.65 4.75,37.65 4.7,37.7 4.7,38 5,38.3 5.35,38.3 5.55,38.1 6.55,38.1 6.6,38.05 6.6,36.75 6.65,36.7 7.65,36.7 7.7,36.65 7.7,35.85 7.65,35.8 5.7,35.8 5.65,35.85
1V8 on Top Layer: 16.68,38.42 17.57,38.42 17.57,35.72 16.68,35.72
3V3 on Top Layer: 29.45,18.33 31.15,18.33 31.15,17.62 29.45,17.62
3V3 on Top Layer: 7.8,23.95 7.85,23.9 9.05,23.9 9.1,23.95 9.1,25.1 9.15,25.15 10,25.15 10.05,25.1 10.05,24.05 10,24 9.8,24 9.75,23.95 9.75,20.1 9.7,20.05 9.15,20.05 9.1,20.1 9.1,21.9 7.9,21.9 7.85,21.85 7.85,21.1 7.8,21.05 6.8,21.05 6.75,21.1 6.75,21.55 6.7,21.6 5.9,21.6 5.85,21.65 5.85,23.85 5.9,23.9 7.1,23.9 7.15,23.95 7.15,25.2 7.2,25.25 7.75,25.25 7.8,25.2
3V3 on Top Layer: 11.9,22.7 11.85,22.65 11.85,22.1 11.9,22.05 11.9,21.7 11.85,21.65 11.85,21.1 11.9,21.05 12.5,21.05 12.55,21.1 12.55,22.65 12.5,22.7
3V3 on Top Layer: 29.57,21.15 30.25,21.15 30.25,19.55 29.57,19.55
3V3 on Top Layer: 12.1,16.9 12.07,16.9 12.07,15.22 11.07,15.22 11.07,17.53 11.12,17.53 11.15,17.55 12.5,17.55 12.55,17.6 12.55,18.15 12.6,18.2 13.45,18.2 13.5,18.15 13.5,17 13.45,16.95 12.15,16.95
3V3 on Top Layer: 3.75,38.85 3.8,38.9 4.5,38.9 4.15,38.55 4.15,38.3 4.5,37.95 4.5,36.38 4.45,36.33 3.8,36.33 3.75,36.38
3V3 on Top Layer: 27.85,39.22 29.35,39.22 29.35,38.15 27.85,38.15
3V3 on Top Layer: 17.43,1.55 19.12,1.55 19.12,0.8 17.43,0.8
3V3 on Inner2: 0,40 32,40 32,0 0,0
5V on Top Layer: 3.93,19.17 5.45,19.17 5.45,18.1 3.93,18.1
5V on Top Layer: 8.9,7.4 8.85,7.35 8.85,6.85 8.8,6.8 5.6,6.8 4.4,8 1.35,8 1.3,8.05 1.3,10 1.35,10.05 3.9,10.05 5.6,8.35 8.8,8.35 8.85,8.3 8.85,10.15 8.9,10.2 11.55,10.2 11.6,10.15 11.6,9.7 11.65,9.65 11.65,9 11.6,8.95 10.25,8.95 10.2,8.9 10.2,8.2 10.15,8.15 9.2,8.15 9.15,8.1 9.15,7.45 9.1,7.4
5V on Top Layer: 13.7,13.9 13.65,13.95 11.03,13.95 11.03,14.97 14.72,14.97 14.72,12.97 13.7,12.97
5V on Top Layer: 23.4,8.8 25.78,8.8 25.78,7.83 23.4,7.83
5V on Inner2: 6.15,11.8 7.05,11.8 7.05,10.3 7.1,10.25 12.05,10.25 12.05,0 5.4,0 5.4,10.25 6.1,10.25 6.15,10.3
AVDD_AUD on Top Layer: 11.15,19.6 12.5,19.6 12.5,20 12.45,20.05 11.9,20.05 11.85,20.1 11.85,20.65 11.9,20.7 13.45,20.7 13.5,20.65 13.5,18.75 13.45,18.7 12.05,18.7 12,18.65 12,17.9 11.95,17.85 11.15,17.85 11.1,17.9 11.1,19.55
GND on Top Layer: 0,40 32,40 32,0 0,0
GND on Bottom Layer: 0,40 32,40 32,0 0,0
GND on Inner1: 0,40 32,40 32,0 0,0
VIN on Top Layer: 12.3,3.55 12.6,3.85 12.6,5.35 12.65,5.4 16.55,5.4 16.6,5.35 16.6,3.8 16.55,3.75 14.6,3.75 13.5,2.65 6.5,2.65 6.5,3.55
VIN on Top Layer: 21.88,5.9 21.93,5.85 21.93,4.15 21.88,4.1 16.93,4.1 16.57,3.75 16.43,3.75 16.43,5.4 20.85,5.4 21.35,5.9
MP9447_LC on Top Layer: 11.32,2.55 11.32,1.7 7.5,1.7 6.9,1.1 4.05,1.1 3.95,1.2 3.95,3.7 3.85,3.8 1.35,3.8 1.3,3.85 1.3,5.8 1.35,5.85 4.5,5.85 4.8,5.55 4.8,2 4.85,1.95 6.2,1.95 6.25,2 6.25,2.5 6.3,2.55
$3N1561 on Top Layer: 16.74,17.18 16.64,17.08 16.64,15.18 16.24,14.78 15.86,14.78 15.79,14.71 15.79,14.13 15.86,14.06 16.81,14.06 17.84,15.08 17.84,17.08 17.74,17.18
$3N1576 on Top Layer: 4.65,21.55 4.65,20.35 4.6,20.3 3.95,20.3 3.9,20.35 3.9,21.55 3.85,21.6 3.7,21.6 3.65,21.65 3.65,23.85 3.7,23.9 4.7,23.9 4.75,23.85 4.75,21.65
$3N1592 on Top Layer: 14,11.53 13.95,11.47 13.95,9.72 13.9,9.67 12.8,9.67 12.75,9.62 12.75,9.03 12.8,8.97 15.03,8.97 15.07,9.03 15.07,11.47 15.03,11.53

Small or netless copper shapes (teardrops, artwork), in the pictures only: 157 on Top Layer, 38 on Bottom Layer, 2 on Inner1, 34 on Inner2

## Text on the board
Bottom Silkscreen Layer: GND | 5V | DM | DP
Top Solder Mask Layer: urmouky v1.0 | OpenIPC
Top Silkscreen Layer: 250719 | 2-6S/5A | PWR / SYS | TF | RX- / RX+ / TX- / TX+ | GND / 5VIn / TXD / RXD | 5V / GND | GND / GND / TXD / RXD / GND / VIN | FAN | SSC338Q | IMU | Camera | RST | TF_CARD | ETH | FLASH | TO_FC | UARTD
